# Altium schematic sheet Pigeon.SchDoc
size A4
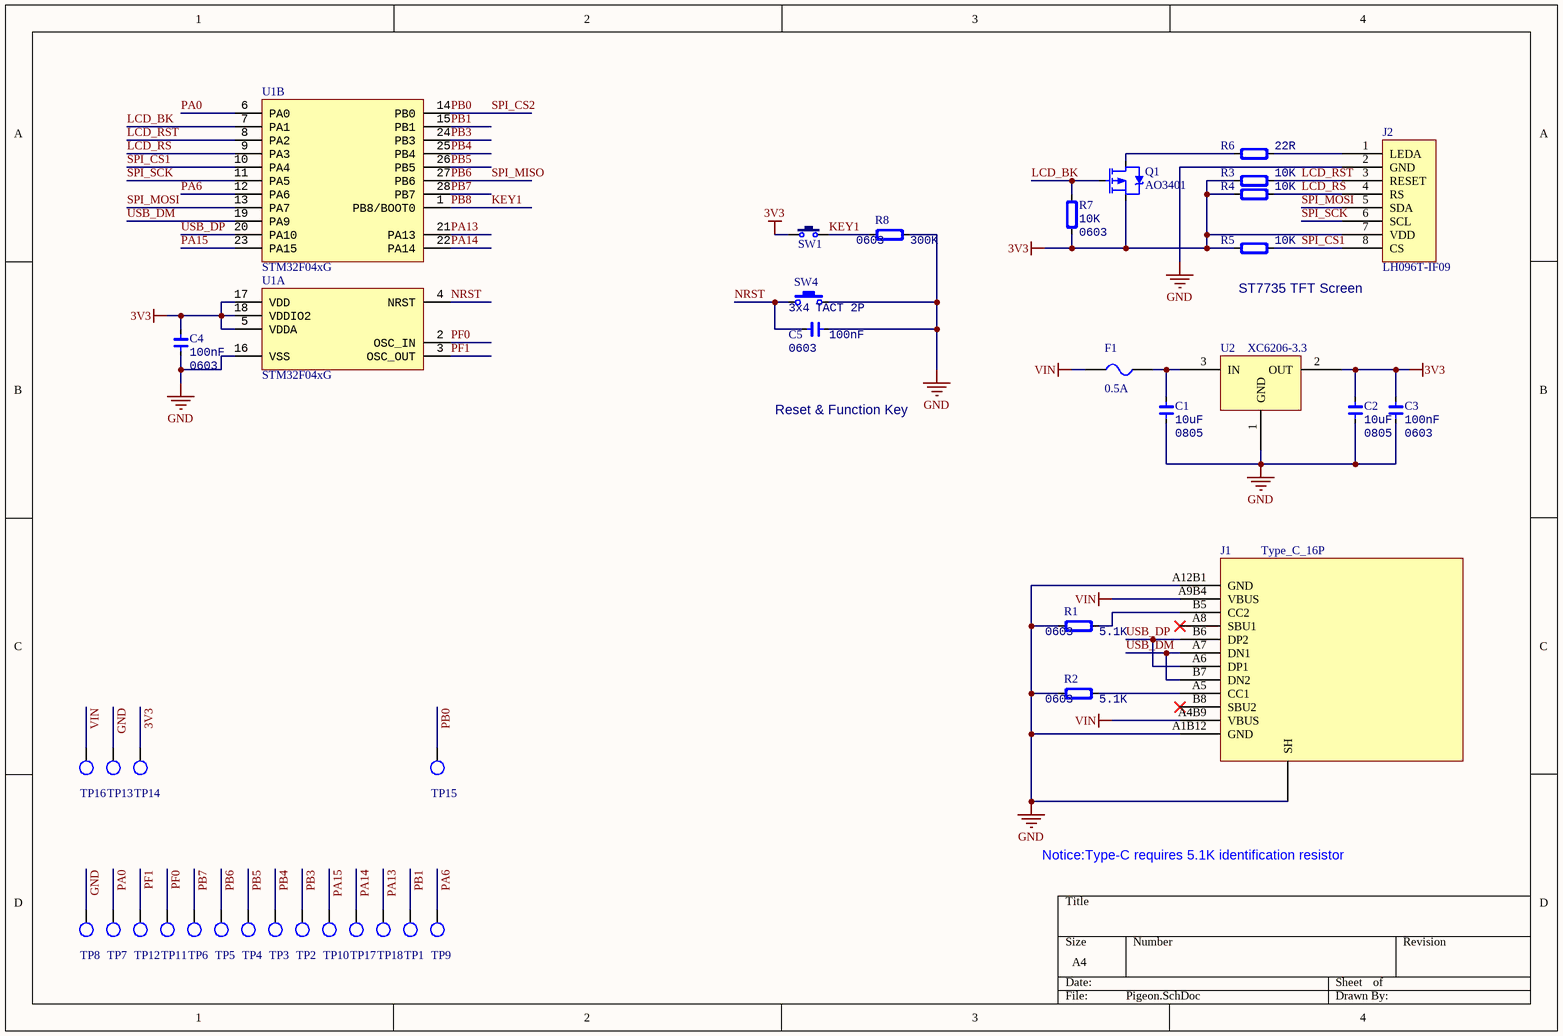
[diagram p0: Pigeon.SchDoc]

## Parts
C1  value 10uF  Type: 0805  [CAP_0805]  (hidden comment: C0805)
C2  value 10uF  Type: 0805  [CAP_0805]  (hidden comment: C0805)
C3  value 100nF  Type: 0603  [CAP_0603]  (hidden comment: C0603)
C4  value 100nF  Type: 0603  [CAP_0603]  (hidden comment: C0603)
C5  value 100nF  Type: 0603  [CAP_0603]  (hidden comment: C0603)
F1  0.5A  [FU 0805]
J1  Type_C_16P  [Type_C_16P]
J2  LH096T-IF09  [LH096T-IF09]
Q1  AO3401  [SOT23-3]
R1  value 5.1K  Type: 0603  [RES_0603]  (hidden comment: R0603)
R2  value 5.1K  Type: 0603  [RES_0603]  (hidden comment: R0603)
R3  value 10K  [RES_0603]  (hidden comment: R0603)
R4  value 10K  [RES_0603]  (hidden comment: R0603)
R5  value 10K  [RES_0603]  (hidden comment: R0603)
R6  value 22R  [RES_0603]  (hidden comment: R0603)
R7  value 10K  Type: 0603  [RES_0603]  (hidden comment: R0603)
R8  value 300K  Type: 0603  [RES_0603]  (hidden comment: R0603)
SW1  3x6x5  [TSW 3*6*4.3-S-W]  (value not drawn)
SW4  value 3x4  [ButtonTACT_3x4x2_180]  (hidden comment: TACT 2P)
TP1  TestPin 1.2R 0.3R  [TestPin_1.2R_0.3R]  (value not drawn)
TP2  TestPin 1.2R 0.3R  [TestPin_1.2R_0.3R]  (value not drawn)
TP3  TestPin 1.2R 0.3R  [TestPin_1.2R_0.3R]  (value not drawn)
TP4  TestPin 1.2R 0.3R  [TestPin_1.2R_0.3R]  (value not drawn)
TP5  TestPin 1.2R 0.3R  [TestPin_1.2R_0.3R]  (value not drawn)
TP6  TestPin 1.2R 0.3R  [TestPin_1.2R_0.3R]  (value not drawn)
TP7  TestPin 1.2R 0.3R  [TestPin_1.2R_0.3R]  (value not drawn)
TP8  TestPin 1.2R 0.3R  [TestPin_1.2R_0.3R]  (value not drawn)
TP9  TestPin 1.2R 0.3R  [TestPin_1.2R_0.3R]  (value not drawn)
TP10  TestPin 1.2R 0.3R  [TestPin_1.2R_0.3R]  (value not drawn)
TP11  TestPin 1.2R 0.3R  [TestPin_1.2R_0.3R]  (value not drawn)
TP12  TestPin 1.2R 0.3R  [TestPin_1.2R_0.3R]  (value not drawn)
TP13  TestPin 1.2R 0.3R  [TestPin_1.2R_0.3R]  (value not drawn)
TP14  TestPin 1.2R 0.3R  [TestPin_1.2R_0.3R]  (value not drawn)
TP15  TestPin 1.2R 0.3R  [TestPin_1.2R_0.3R]  (value not drawn)
TP16  TestPin 1.2R 0.3R  [TestPin_1.2R_0.3R]  (value not drawn)
TP17  TestPin 1.2R 0.3R  [TestPin_1.2R_0.3R]  (value not drawn)
TP18  TestPin 1.2R 0.3R  [TestPin_1.2R_0.3R]  (value not drawn)
U1  STM32F04xG  [QFN_P0.5_28_NOPAD]  (parts A,B of 2)
U2  XC6206-3.3  [SOT23-3]

## Nets
3V3: C2.2 C3.2 C4.2 J2.7(VDD) Q1.2(S) R3.1 R4.1 R5.1 R7.1 SW1.1 TP14.0 U1.5(VDDA) U1.17(VDD) U1.18(VDDIO2) U2.2(OUT)
GND: C1.1 C2.1 C3.1 C4.1 C5.1 J1.0(SH) J1.A1B12(GND) J1.A12B1(GND) J2.2(GND) R1.1 R2.1 R8.2 SW4.2 TP8.0 TP13.0 U1.16(VSS) U2.1(GND)
VIN: F1.1 J1.A4B9(VBUS) J1.A9B4(VBUS) TP16.0
KEY1: R8.1 SW1.2 U1.1(PB8/BOOT0)  [also labelled PB8]
LCD_BK: Q1.1(G) R7.2 U1.7(PA1)
LCD_RS: J2.4(RS) R4.2 U1.9(PA3)
LCD_RST: J2.3(RESET) R3.2 U1.8(PA2)
NRST: C5.2 SW4.1 U1.4(NRST)
PA0: TP7.0 U1.6(PA0)
PA6: TP9.0 U1.12(PA6)
PA13: TP18.0 U1.21(PA13)
PA14: TP17.0 U1.22(PA14)
PA15: TP10.0 U1.23(PA15)
PB0: TP15.0 U1.14(PB0)  [also labelled SPI_CS2]
PB1: TP1.0 U1.15(PB1)
PB3: TP2.0 U1.24(PB3)
PB4: TP3.0 U1.25(PB4)
PB5: TP4.0 U1.26(PB5)
PB6: TP5.0 U1.27(PB6)  [also labelled SPI_MISO]
PB7: TP6.0 U1.28(PB7)
PF0: TP11.0 U1.2(OSC_IN)
PF1: TP12.0 U1.3(OSC_OUT)
SPI_CS1: J2.8(CS) R5.2 U1.10(PA4)
SPI_MOSI: J2.5(SDA) U1.13(PA7)
SPI_SCK: J2.6(SCL) U1.11(PA5)
USB_DM: J1.A7(DN1) J1.B7(DN2) U1.19(PA9)
USB_DP: J1.A6(DP1) J1.B6(DP2) U1.20(PA10)
NetC1_2: C1.2 F1.2 U2.3(IN)
NetJ1_A5: J1.A5(CC1) R2.2
NetJ1_B5: J1.B5(CC2) R1.2
NetJ2_1: J2.1(LEDA) R6.1
NetQ1_3: Q1.3(D) R6.2

Not connected (* = marked no-connect by the designer): J1 A8(SBU1)* B8(SBU2)*

## Notes on the sheet
- ST7735 TFT Screen
- Reset & Function Key
- Notice:Type-C requires 5.1K identification resistor

## Library data of the parts
C1 C2 = Cap_0805: Capacitor; Specification: X7R 50V; Manufacturer: *
C3-C5 = Cap_0603: Capacitor; Specification: X7R 50V; Manufacturer: *
F1 = FU: 自恢复 0.5A C75464; BOM名称: 贴片保险丝; 版权归属: 源创客; 学习资源: www.ooocke.com
R1 R2 = Res_0603: Resistor 5%; Manufacturer: *; Specification: ±5%
R3-R8 = Res_0603: Resistor; Specification: ±5%; Manufacturer: *
  R3-R6: Type: 0603
SW1 = TSW 3x6: 3x6轻触开关; 版权归属: 源创客; BOM名称: 3x6轻触开关; 学习资源: www.ooocke.com
SW4 = ButtonTACT_3x4x2_180: Button; type: TACT 2P
U1 = STM32F04xG: MCU